# Altium schematic sheet AMU-S09-V00-AMSMicrofit.SchDoc: CANBUS Micro-Fit
size A3; DrawnBy: Thomas Benedetti; DocumentNumber: 9; SheetNumber: 9; SheetTotal: 25; Version: 00; Project: AMU 2020; PageSetup: Record=PageOptions|CenterHorizontal=True|CenterVertical=True|PrintScale=0.97|XCorrection=1.00|YCorrection=1.00|PrintKind=0|BorderSize=5000000|LeftOffset=0|BottomOffset=0|Orientation=2|PaperLength=1000|PaperWidth=1000|Scale=100|PaperSource=7|PrintQuality=-4|MediaType=1|DitherType=10|PaperKind=A4|PrintScaleMode=1
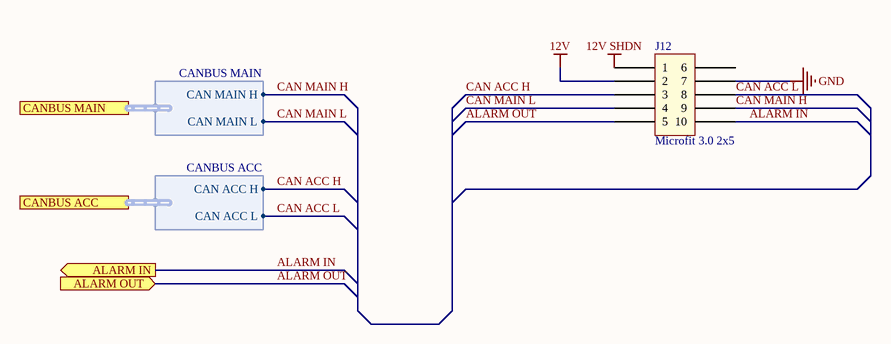
[diagram p0: AMU-S09-V00-AMSMicrofit.SchDoc]

## Parts
J12  Microfit 3.0 2x5  [Microfit_2X5_R_TH]

## Ports
ALARM IN (out), ALARM OUT (in), CANBUS ACC (harness CANBUS ACC), CANBUS MAIN (harness CANBUS MAIN)

## Harnesses
CANBUS MAIN: CAN MAIN H, CAN MAIN L
CANBUS ACC: CAN ACC H, CAN ACC L

## Nets
12V: J12.2
12V SHDN: J12.1
GND: J12.7
ALARM IN: J12.10 ; port ALARM IN
ALARM OUT: J12.5 ; port ALARM OUT
CAN ACC H: J12.3 ; port CANBUS ACC.CAN ACC H
CAN ACC L: J12.8 ; port CANBUS ACC.CAN ACC L
CAN MAIN H: J12.9 ; port CANBUS MAIN.CAN MAIN H
CAN MAIN L: J12.4 ; port CANBUS MAIN.CAN MAIN L

Not connected (* = marked no-connect by the designer): J12 6

## Notes on the sheet
- Revision History:
- Sheet Title:
- Rev
- Date
- Description
- Project:
- Size:
- Drawn By:
- A3
- Number:
- Revision:
- Sheet
- Version:
- of
- QUT Motorsport
- O-120, Gardens Point
- 2 George Street
- Brisbane, QLD 4000
- Australia
- Print Date:
- Print Time:
- File Name:

## Library data of the parts
J12 = Microfit_2x5